# EAGLE design es11quematico_tesis_brd (EAGLE 7.6.0)
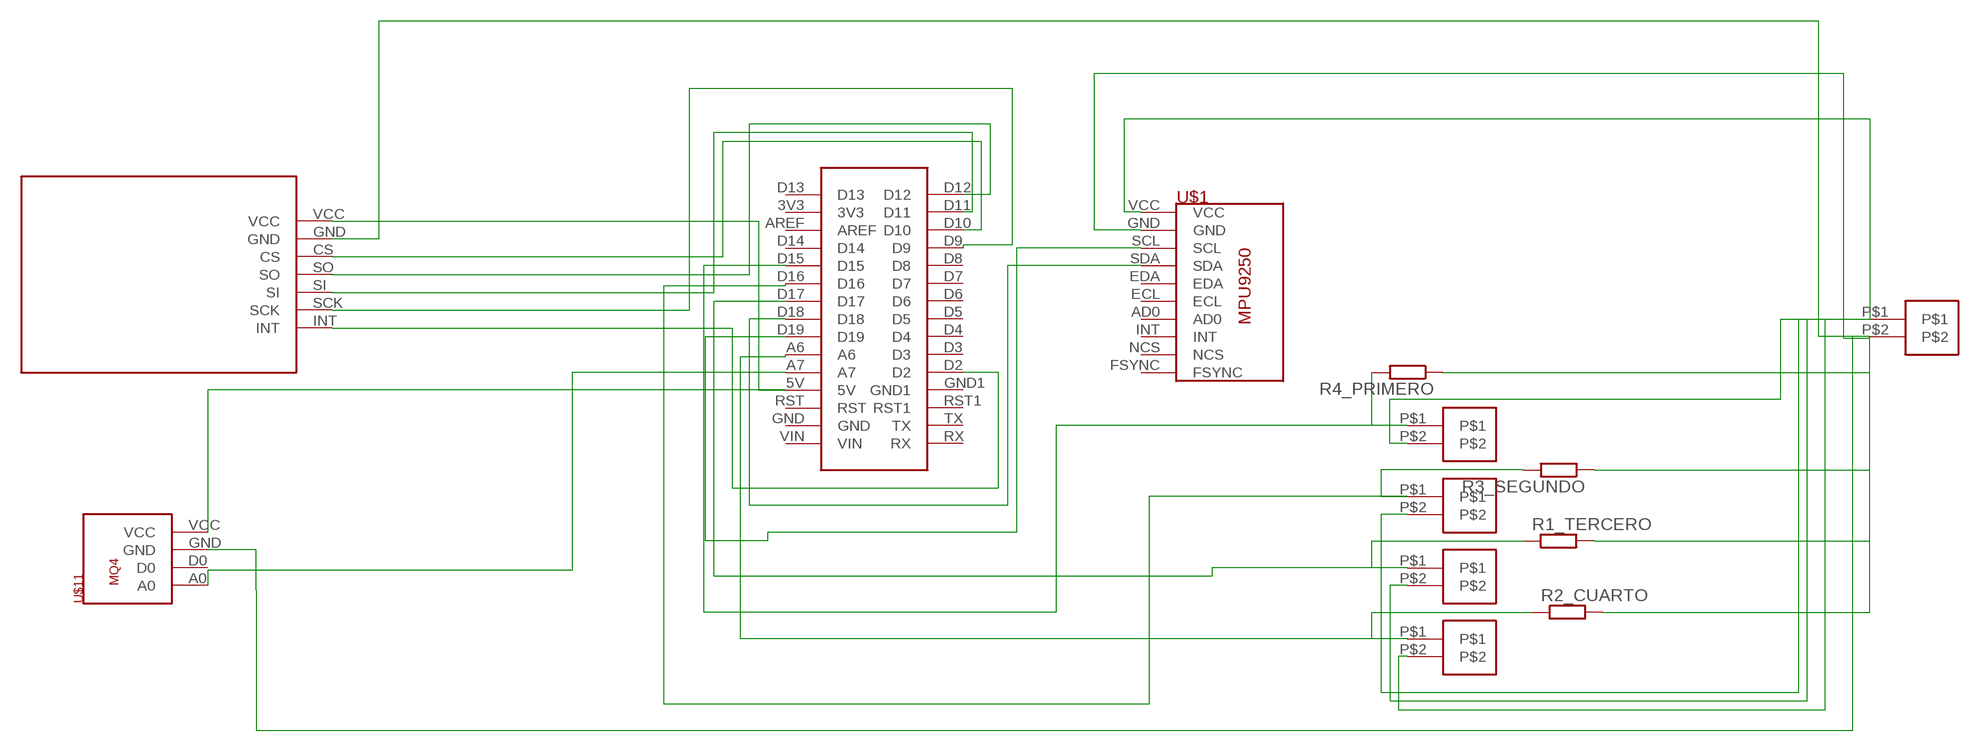
[diagram p0: schematic, sheet 1]

## Parts
ALIMENTACION  FSR402  [FSR402]
CUARTO_FSR  FSR402  [FSR402]
PRIMER_FSR  FSR402  [FSR402]
R1_TERCERO  R-EU_0613/5V  [P0613V]
R2_CUARTO  R-EU_0613/5V  [P0613V]
R3_SEGUNDO  R-EU_0613/5V  [P0613V]
R4_PRIMERO  R-EU_0613/5V  [P0613V]
SEGUNDO_FSR  FSR402  [FSR402]
TERCER_FSR  FSR402  [FSR402]
U$1  MPU9250  [MPU9250]
U$2  ARDUINO-NANO  [ARDUINO-NANO]
U$8  MCP2515  [MCP2515]
U$11  MQ4  [MQ4]

## Nets
N$1: ALIMENTACION.P$1 CUARTO_FSR.P$2 PRIMER_FSR.P$2 SEGUNDO_FSR.P$2 TERCER_FSR.P$2 U$1.VCC
N$2: U$2.D10 U$8.CS
N$3: ALIMENTACION.P$2 R1_TERCERO.2 R2_CUARTO.2 R3_SEGUNDO.1 R4_PRIMERO.1 U$1.GND U$8.GND U$11.GND
N$4: U$2.D12 U$8.SO
N$5: U$2.D11 U$8.SI
N$6: U$2.D9 U$8.SCK
N$7: U$2.D2 U$8.INT
N$8: PRIMER_FSR.P$1 R4_PRIMERO.2 U$2.D15
N$9: U$2.A7 U$11.A0
N$10: U$1.SCL U$2.D19
N$11: U$1.SDA U$2.D18
N$13: CUARTO_FSR.P$1 R2_CUARTO.1 U$2.A6
N$14: R1_TERCERO.1 TERCER_FSR.P$1 U$2.D17
N$15: R3_SEGUNDO.2 SEGUNDO_FSR.P$1 U$2.D16
N$18: U$2.5V U$8.VCC U$11.VCC
Unconnected: U$1.AD0 U$1.ECL U$1.EDA U$1.FSYNC U$1.INT U$1.NCS U$2.3V3 U$2.AREF U$2.D3 U$2.D4 U$2.D5 U$2.D6 U$2.D7 U$2.D8 U$2.D13 U$2.D14 U$2.GND U$2.GND1 U$2.RST U$2.RST1 U$2.RX U$2.TX U$2.VIN U$11.D0

## Library data of the parts
ALIMENTACION CUARTO_FSR PRIMER_FSR SEGUNDO_FSR TERCER_FSR = FSR:FSR402
R1_TERCERO R2_CUARTO R3_SEGUNDO R4_PRIMERO = resistor:R-EU_: RESISTOR, European symbol
U$1 = MPU9250:MPU9250
U$2 = ARDUINO_NANO:ARDUINO-NANO
U$8 = MCP2515-1:MCP2515
U$11 = MPU9250:MQ4

## Board
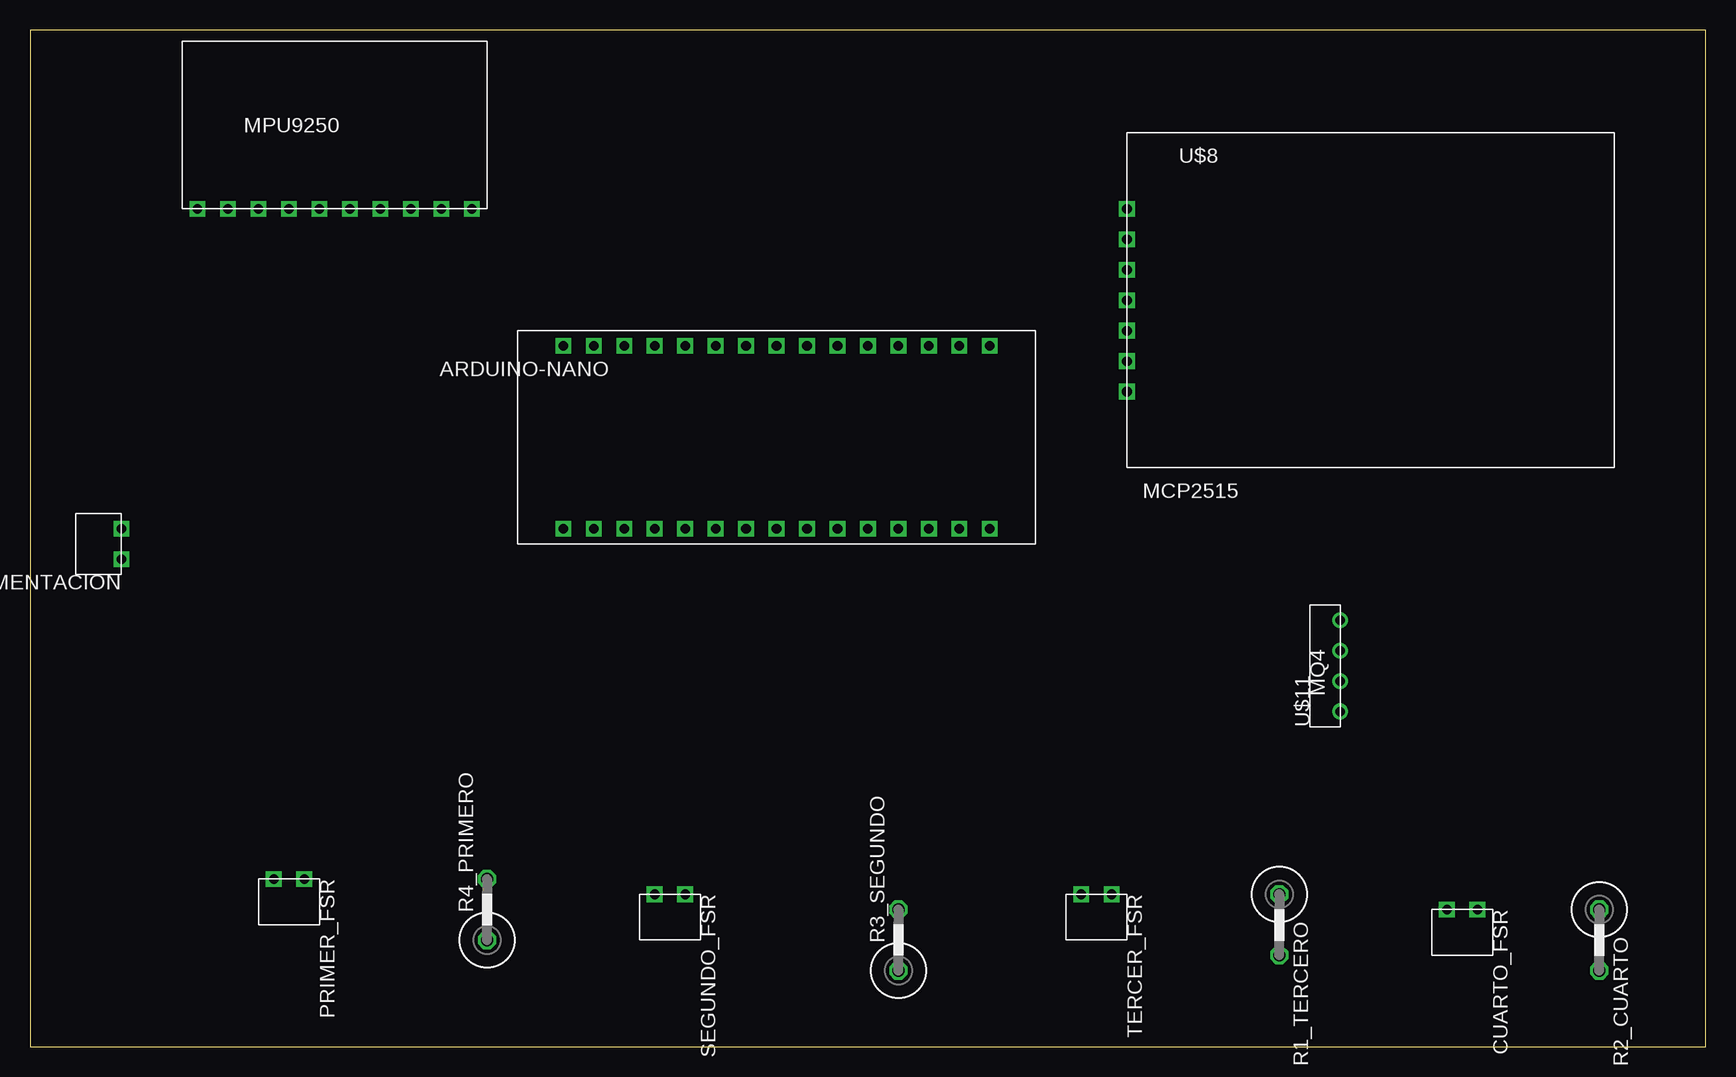
[diagram p1: board, top side]
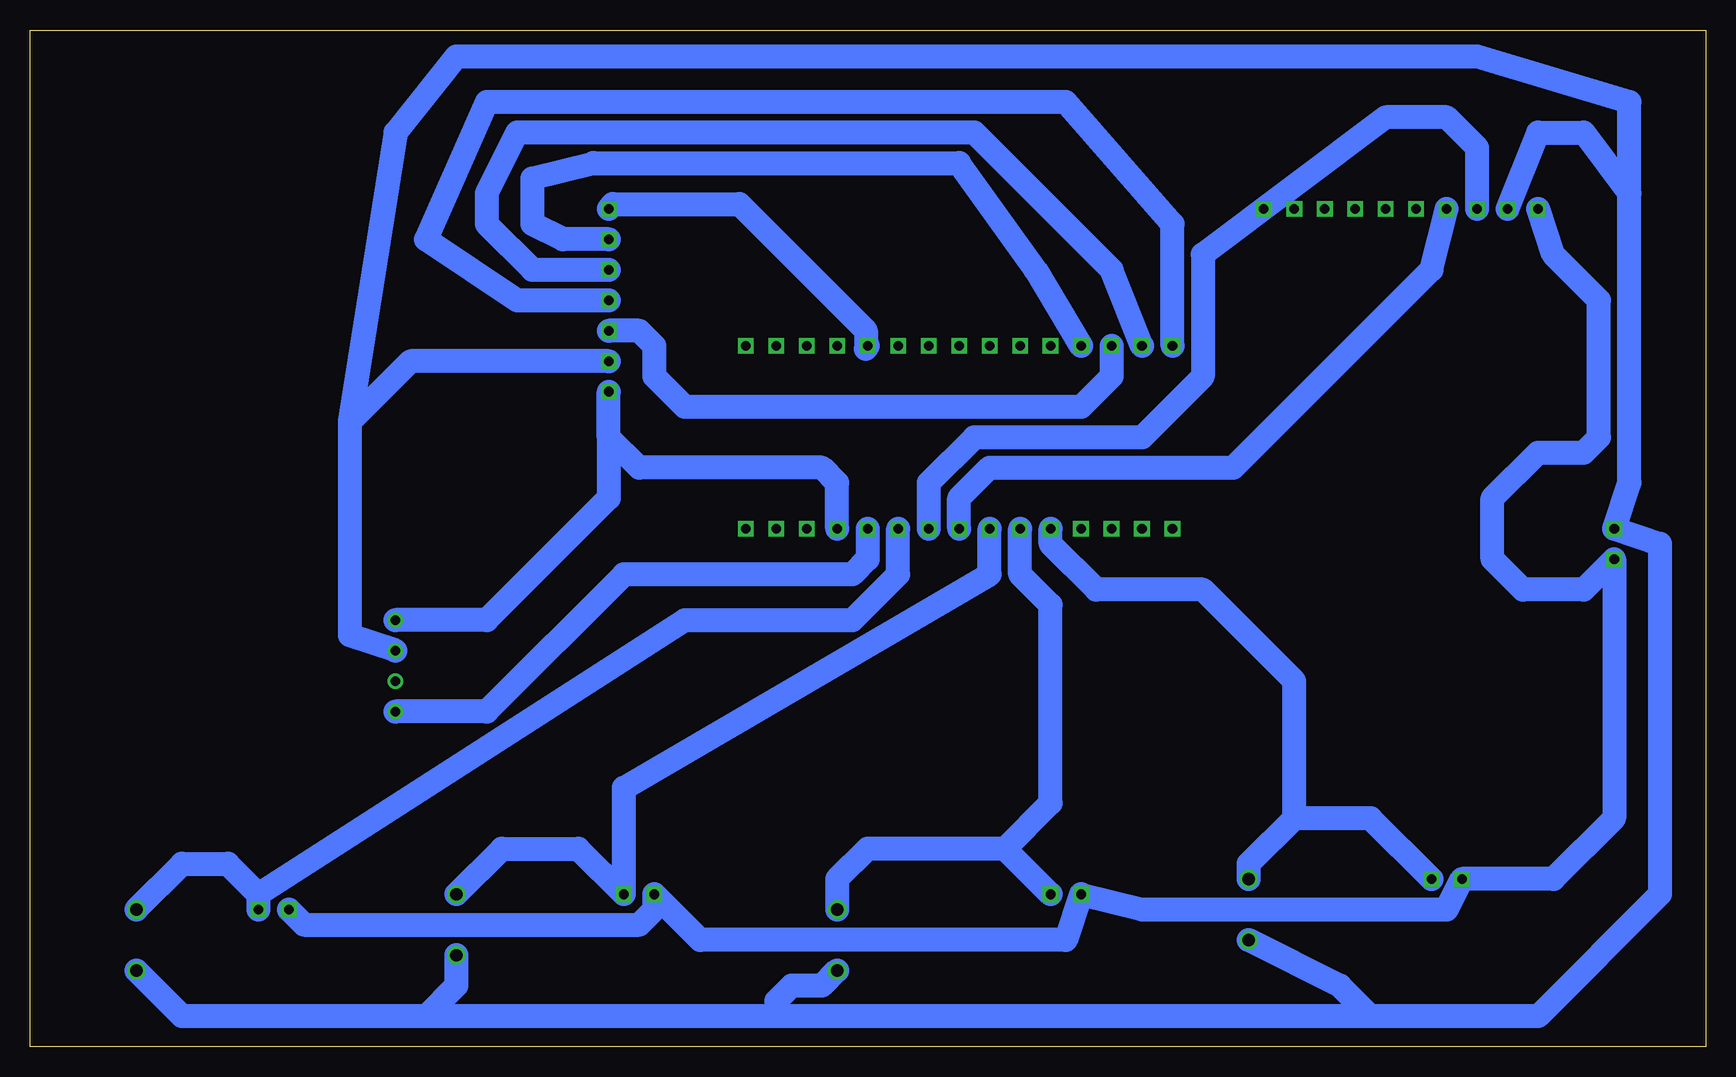
[diagram p2: board, bottom side, seen from below]

Size 139.68 x 84.76 mm. Coordinates in mm from the lower left corner, seen from the top.
Outline: 0,0 139.68,0 139.68,84.76 0,84.76 0,0
Copper layers (1*16): Top 0.035mm / dielectric 1.5mm / Bottom 0.035mm
Design rules "default *": minimum track width 2mm, minimum drill 24mil, track to track 40mil, track to pad 8mil, pad to pad 8mil, via to via 8mil, smd to smd 8mil, copper to edge 40mil, drill to drill 8mil, minimum pad ring 10mil, minimum via ring 8mil, stop-mask expansion 4mil, vias tented up to drill 0mil, thermal gap 10mil

### Footprints (pad centres in the part's own frame; a part is rotated, then mirrored left to right if it is on the bottom)
FSR402 = drill 0.8 square: P$1 -5.08,2.54; P$2 -2.54,2.54
P0613V = drill 1.016 octagon: 1 -2.54,0; 2 2.54,0
MPU9250 = drill 0.8 square: AD0 -5.08,10.16; ECL -7.62,10.16; EDA -10.16,10.16; FSYNC 2.54,10.16; GND -17.78,10.16; INT -2.54,10.16; NCS 0,10.16; SCL -15.24,10.16; SDA -12.7,10.16; VCC -20.32,10.16
ARDUINO-NANO = drill 0.8 square: 3V3 -7.62,17.78; 5V -7.62,-7.62; A6 -7.62,-2.54; A7 -7.62,-5.08; AREF -7.62,15.24; D2 7.62,-5.08; D3 7.62,-2.54; D4 7.62,0; D5 7.62,2.54; D6 7.62,5.08; D7 7.62,7.62; D8 7.62,10.16; D9 7.62,12.7; D10 7.62,15.24; D11 7.62,17.78; D12 7.62,20.32; D13 -7.62,20.32; D14 -7.62,12.7; D15 -7.62,10.16; D16 -7.62,7.62; D17 -7.62,5.08; D18 -7.62,2.54; D19 -7.62,0; GND -7.62,-12.7; GND1 7.62,-7.62; RST -7.62,-10.16; RST1 7.62,-10.16; RX 7.62,-12.7; TX 7.62,-15.24; VIN -7.62,-15.24
MCP2515 = drill 0.8 square: CS 13.97,13.97; GND 13.97,16.51; INT 13.97,3.81; SCK 13.97,6.35; SI 13.97,8.89; SO 13.97,11.43; VCC 13.97,19.05
MQ4 = drill 0.8: A0 -10.16,5.08; D0 -7.62,5.08; GND -5.08,5.08; VCC -2.54,5.08

### Placement (x,y rotation side)
ALIMENTACION  10.16,45.72 90 top
CUARTO_FSR  115.57,13.97 180 top
PRIMER_FSR  17.78,16.51 180 top
R1_TERCERO  104.14,10.16 270 top
R2_CUARTO  130.81,8.89 270 top
R3_SEGUNDO  72.39,8.89 90 top
R4_PRIMERO  38.1,11.43 90 top
SEGUNDO_FSR  49.53,15.24 180 top
TERCER_FSR  85.09,15.24 180 top
U$1  34.29,59.69 0 top
U$2  64.77,50.8 90 top
U$8  105.41,73.66 180 top
U$11  114.3,38.1 90 top

### Tracks (layer width: path | path; a pad name or v marks a point on that pad's centre or on a via)
N$1
  Bottom 2: U$1.VCC 12.7,66.04 8.89,62.23 8.89,50.8 10.16,49.53 13.97,49.53 17.78,45.72 17.78,40.64 15.24,38.1 10.16,38.1 ALIMENTACION.P$1 7.62,19.05 12.7,13.97 PRIMER_FSR.P$2 21.59,11.43 46.99,11.43 SEGUNDO_FSR.P$2 53.34,8.89 83.82,8.89 TERCER_FSR.P$2 87.63,11.43 88.9,10.16 116.84,10.16 CUARTO_FSR.P$2
N$2
  Bottom 2: U$2.D10 49.53,55.88 52.07,53.34 85.09,53.34 87.63,55.88 87.63,58.42 88.9,59.69 U$8.CS
N$3
  Bottom 2: 6.35,71.12 6.35,46.99 ALIMENTACION.P$2 3.81,41.91 3.81,12.7 13.97,2.54 27.94,2.54 | 6.35,71.12 6.35,78.74 19.05,82.55 104.14,82.55 109.22,76.2 113.03,52.07 | 113.03,52.07 113.03,34.29 U$11.GND | 27.94,2.54 77.47,2.54 | 77.47,2.54 106.68,2.54 | 106.68,2.54 127,2.54 R2_CUARTO.2 | R1_TERCERO.2 104.14,5.08 106.68,2.54 | R3_SEGUNDO.1 73.66,5.08 76.2,5.08 77.47,3.81 77.47,2.54 | R4_PRIMERO.1 30.48,5.08 27.94,2.54 | U$1.GND 13.97,76.2 10.16,76.2 6.35,71.12 | U$8.GND 107.95,57.15 113.03,52.07
N$4
  Bottom 2: U$2.D12 44.45,68.58 53.34,78.74 101.6,78.74 106.68,67.31 99.06,62.23 U$8.SO
N$5
  Bottom 2: U$2.D11 49.53,64.77 60.96,76.2 99.06,76.2 101.6,71.12 101.6,68.58 97.79,64.77 U$8.SI
N$6
  Bottom 2: U$8.SCK 95.25,67.31 97.79,68.58 97.79,72.39 92.71,73.66 62.23,73.66 55.88,64.77 U$2.D9
N$7
  Bottom 2: U$2.D2 70,58.18 70,59.68 80.55,70.24 91.11,70.24 U$8.INT
N$8
  Bottom 2: PRIMER_FSR.P$1 27.94,19.05 34.29,19.05 | 34.29,19.05 38.1,15.24 R4_PRIMERO.2 | 34.29,19.05 34.29,30.48 41.91,38.1 50.8,38.1 54.61,41.91 U$2.D15
N$9
  Bottom 2: U$2.A7 69.85,40.64 71.12,39.37 90.17,39.37 101.6,27.94 U$11.A0
N$10
  Bottom 2: U$1.SCL 19.05,74.93 21.59,77.47 26.67,77.47 41.91,66.04 41.91,55.88 46.99,50.8 60.96,50.8 64.77,46.99 U$2.D19
N$11
  Bottom 2: U$2.D18 62.23,45.72 59.69,48.26 39.37,48.26 22.86,64.77 U$1.SDA
N$13
  Bottom 2: R2_CUARTO.1 127,15.24 123.19,15.24 120.65,12.7 | 120.65,12.7 CUARTO_FSR.P$1 | 120.65,12.7 85.09,35.56 71.12,35.56 67.31,39.37 U$2.A6
N$14
  Bottom 2: R1_TERCERO.1 100.33,16.51 93.98,16.51 TERCER_FSR.P$1 90.17,21.59 59.69,39.37 U$2.D17
N$15
  Bottom 2: SEGUNDO_FSR.P$1 58.42,16.51 | 58.42,16.51 69.85,16.51 72.39,13.97 R3_SEGUNDO.2 | 58.42,16.51 54.61,20.32 54.61,36.83 57.15,39.37 U$2.D16
N$18
  Bottom 2: U$2.5V 72.39,46.99 73.66,48.26 88.9,48.26 91.44,50.8 | 91.44,50.8 U$8.VCC | 91.44,50.8 91.44,45.72 101.6,35.56 U$11.VCC